# Altium schematic sheet Sheet2.SchDoc
size A4; SheetNumber: 1; SheetTotal: 1
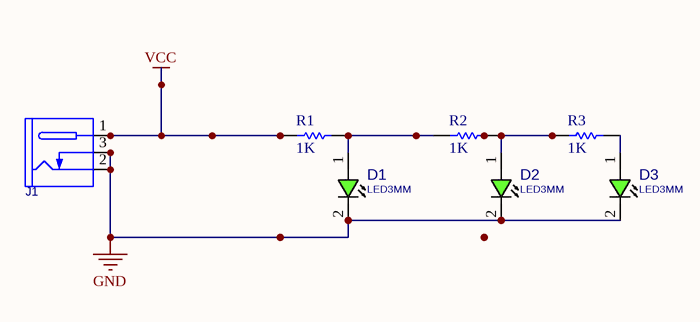
[diagram p0: Sheet2.SchDoc]

## Parts
D1  LED3MM  [LED3MM]
D2  LED3MM  [LED3MM]
D3  LED3MM  [LED3MM]
J1  DC_POWER_JACK  [JAC_PWR1]  (value not drawn)
R1  value 1K  (hidden comment: Resistor)
R2  value 1K  (hidden comment: Resistor)
R3  value 1K  (hidden comment: Resistor)

## Nets
GND: D1.2(CATHODE) D2.2(CATHODE) D3.2(CATHODE) J1.2(SLEEVE) J1.3(INSERTION_DET)
VCC: J1.1(TIP) R1.1
NetD1_1: D1.1(ANODE) R1.2 R2.1
NetD2_1: D2.1(ANODE) R2.2 R3.1
NetD3_1: D3.1(ANODE) R3.2

## Library data of the parts
D1-D3 = LED_THD_3MM: LED, THD, 3MM, GREEN; DESC: DESCRIPTION; MANF_P#: MANF_PART#; PARAM2: 2.2V; MANF: MANF; ASSEMBLY: ASSEMBLY; PRICE: PRICE; VALUE: LED3MM
J1 = CONN_PWR_JACKR1: CONN, PWR JACK DC, PLUG DIAM 1.0MM RA THD; MANF: CUI STACK; MANF_P#: PJ-031CH, PJ-031C; PARAM: CH 3A, C 2A; VALUE: DC_POWER_JACK
R1-R3 = Resistor: TC1: 0; SimulationGenericComponent: True; TC2: 0